# EasyEDA Pro project NeuralAccelerator_EasyEDA.epro, schematic Multiplier
Create Date: 2024-09-15; Page Name: P1; Project Name: Neural; Schematic Name: Multiplier; Update Date: 2024-09-16; Company: EasyEDA.com; Drawn: EasyEDA; Page Size: A4; Part Number: JLCPCB-002; Reviewed: EasyEDA; Version: V0.1
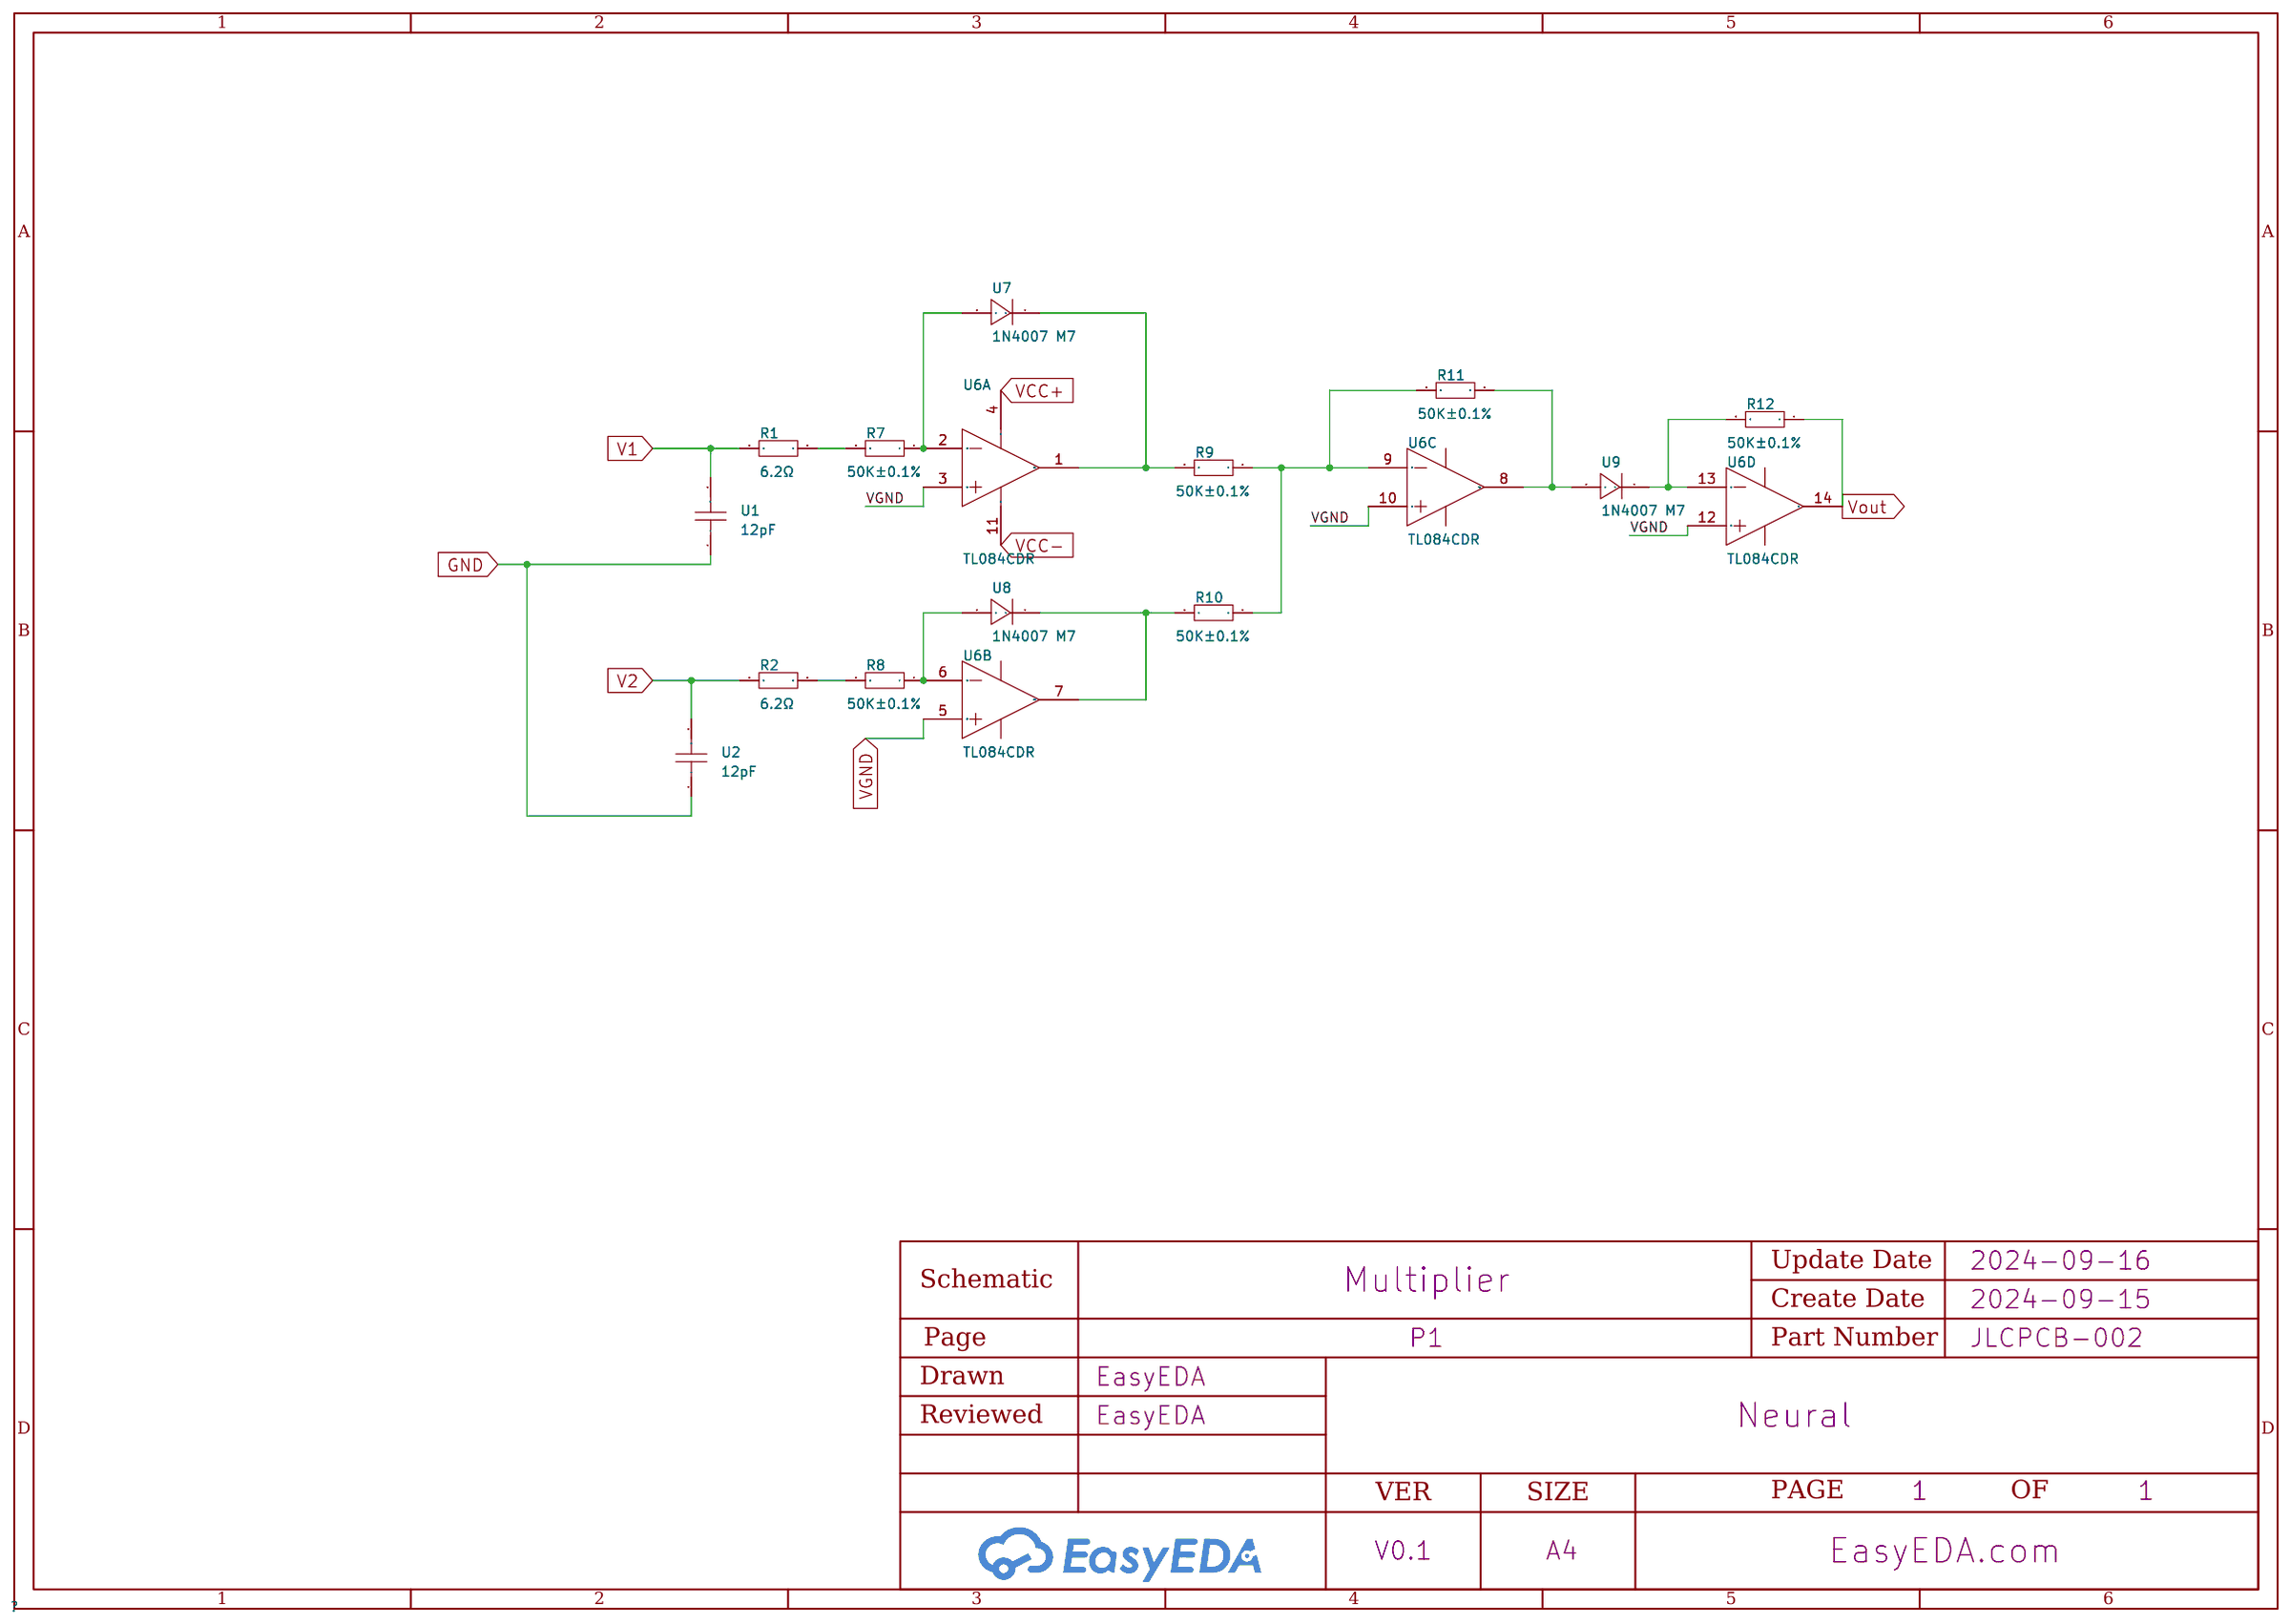
[diagram p1: schematic sheet]

## Parts
R1  6.2Ω  [R1206]
R2  6.2Ω  [R1206]
R7  50K±0.1%  [R1206]
R8  50K±0.1%  [R1206]
R9  50K±0.1%  [R1206]
R10  50K±0.1%  [R1206]
R11  50K±0.1%  [R1206]
R12  50K±0.1%  [R1206]
U1  12pF  [C1206]
U2  12pF  [C1206]
U6  TL084CDR  [SOIC-14_L8.7-W3.9-P1.27-LS6.0-BL]  (sections 1,2,3,4)
U7  1N4007 M7  [SMA_L4.2-W2.7-LS5.3-RD]
U8  1N4007 M7  [SMA_L4.2-W2.7-LS5.3-RD]
U9  1N4007 M7  [SMA_L4.2-W2.7-LS5.3-RD]

## Library data of the parts
R1 R2 = CR1206J406R2G: Type:Thick Film Resistors Resistance: Tolerance:±5% Tolerance:±5% Power(Watts): Overload Voltage (Max): Temperature Coefficient:-250ppm/℃~+500ppm/℃ Temperature Coefficient:-250ppm/℃~+500ppm/℃ Operating Temperature Range:-55℃~+125℃ Operating Temperature Ra; LCSC Part Name: 厚膜电阻 6.2Ω ±5% 250mW; Supplier Part: C102383; Manufacturer: LIZ(丽智电子); Supplier Footprint: 1206; Datasheet: https://atta.szlcsc.com/upload/public/pdf/source/20180403/C189438_6D658388CC7843F35BBC9018D03F0B8E.pdf; Supplier: LCSC; Type: Thick Film Resistors; Tolerance: ±5%; Temperature Coefficient: -250ppm/℃~+500ppm/℃; Operating Temperature Range: -55℃~+125℃
R7-R12 = 50K±0.1%: Supplier Part: C9900008374; Supplier: LCSC
U1 U2 = HC1206CG120G201: Capacitance: Tolerance:±2% Tolerance:±2% Voltage Rated: Temperature Coefficient:; LCSC Part Name: 12pF ±2% 200V; Supplier Part: C3836495; Manufacturer: Meritek; Supplier Footprint: 1206; Datasheet: https://atta.szlcsc.com/upload/public/pdf/source/20240117/558F4B049E06A6854C9EF4B8DE400D8F.pdf; Supplier: LCSC; Tolerance: ±2%
U6 = TL084CDR: Gain Bandwidth Product(GBP):3MHz Current - Input Bias(Ib):30pA Voltage - Input Offset(Vos):3mV Slew Rate(SR):13V/us Supply Current Per Channel:1.4mA Operating Temperature:0℃~+70℃ Operating Temperature:0℃~+70℃; Supplier Part: C8956; Manufacturer: TI(德州仪器); Supplier Footprint: SOIC-14; Datasheet: https://www.ti.com/cn/lit/gpn/tl084; Supplier: LCSC; Gain Bandwidth Product(GBP): 3MHz; Current - Input Bias(Ib): 30pA; Voltage - Input Offset(Vos): 3mV; Slew Rate(SR): 13V/us; Supply Current Per Channel: 1.4mA; Operating Temperature: 0℃~+70℃
U7-U9 = 1N4007 M7: Supplier Part: C2895256; Supplier Footprint: SMA(4.3x2.7); Supplier: LCSC

## Nets
GND: U1.1 U2.1
V1: R1.1 U1.2
V2: R2.1 U2.2
VCC+: U6.4(VCC+)
VCC-: U6.11(VCC-)
VGND: U6.3(IN1+) U6.5(IN2+) U6.10(IN3+) U6.12(IN4+)
Vout: R12.1 U6.14(OUT4)
$1N1615: R7.1 U6.2(IN1-) U7.2(A)
$1N1657: R8.1 U6.6(IN2-) U8.2(A)
$1N1729: R10.2 U6.7(OUT2) U8.1(K)
$1N1735: R9.2 U6.1(OUT1) U7.1(K)
$1N1793: R9.1 R10.1 R11.2 U6.9(IN3-)
$1N1839: R11.1 U6.8(OUT3) U9.2(A)
$1N1881: R12.2 U6.13(IN4-) U9.1(K)
$1N17644: R1.2 R7.2
$1N17777: R2.2 R8.2
